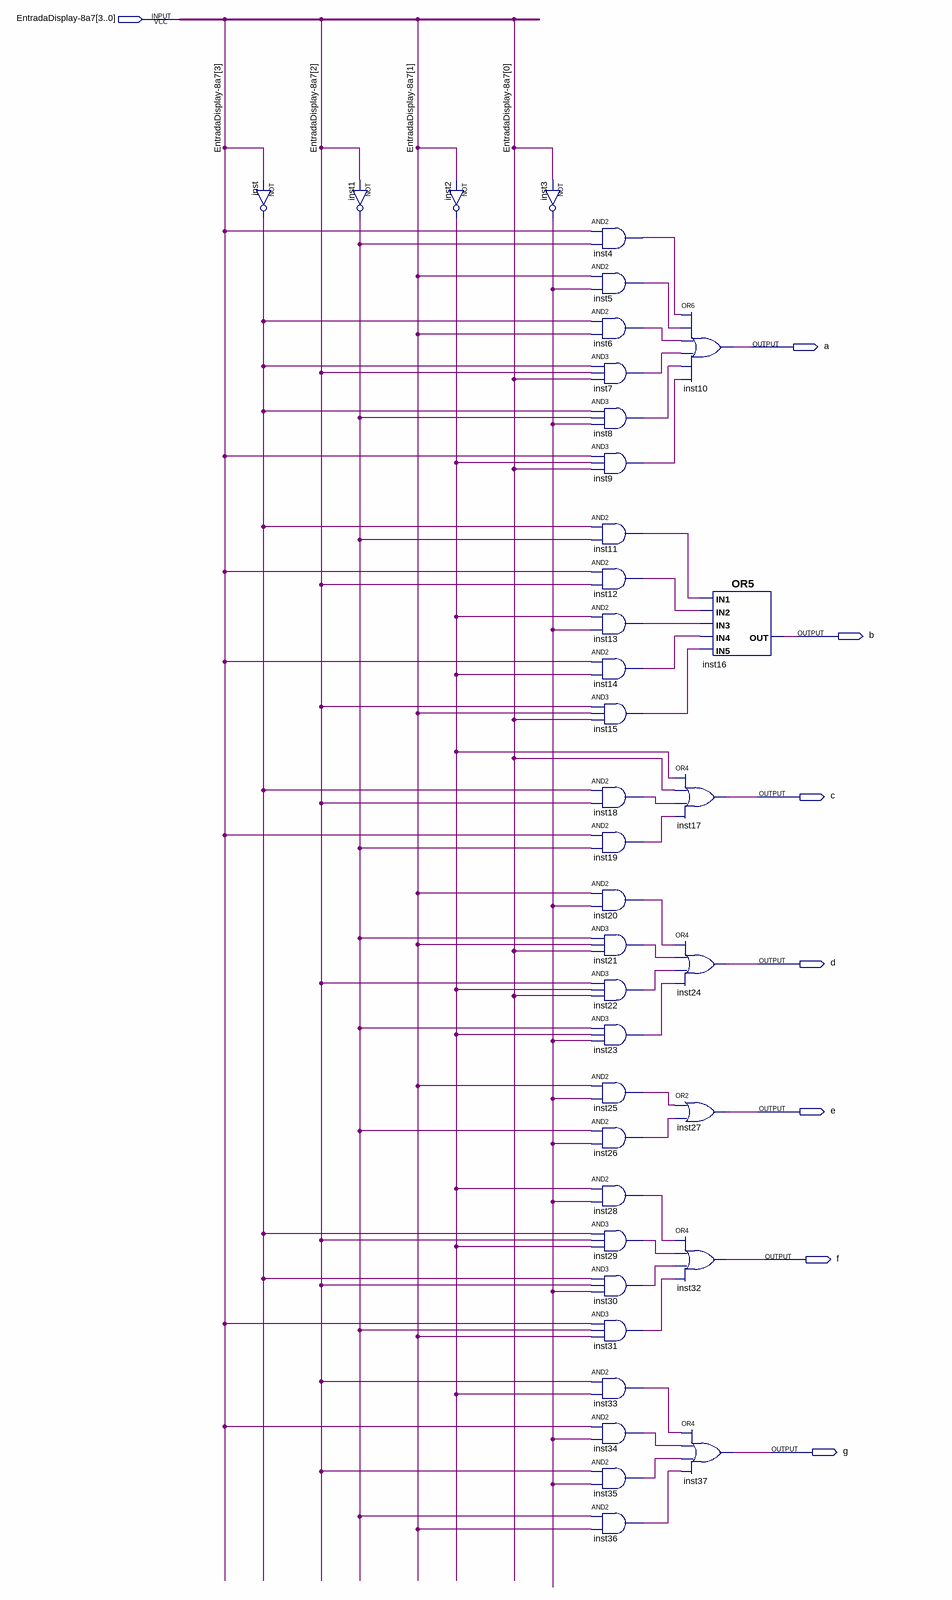
[diagram p0: schematic sheet]
// Quartus schematic Display-8a7.bdf as structural Verilog: 38 symbols, 8 pins
module \Display-8a7  (
  input  [3:0] \EntradaDisplay-8a7 ,
  output a,
  output b,
  output c,
  output d,
  output e,
  output f,
  output g
);

  wire inst1_out, inst2_out, inst3_out, inst4_out, inst5_out, inst6_out, inst7_out, inst8_out, inst9_out,
       inst11_out, inst12_out, inst13_out, inst14_out, inst15_out, inst18_out, inst19_out, inst20_out,
       inst21_out, inst22_out, inst23_out, inst25_out, inst26_out, inst28_out, inst29_out, inst30_out,
       inst31_out, inst33_out, inst34_out, inst35_out, inst36_out, inst_out;

  not inst (inst_out, \EntradaDisplay-8a7 [3]);
  not inst1 (inst1_out, \EntradaDisplay-8a7 [2]);
  not inst2 (inst2_out, \EntradaDisplay-8a7 [1]);
  not inst3 (inst3_out, \EntradaDisplay-8a7 [0]);
  and inst4 (inst4_out, \EntradaDisplay-8a7 [3], inst1_out);
  and inst5 (inst5_out, \EntradaDisplay-8a7 [1], inst3_out);
  and inst6 (inst6_out, inst_out, \EntradaDisplay-8a7 [1]);
  and inst7 (inst7_out, inst_out, \EntradaDisplay-8a7 [2], \EntradaDisplay-8a7 [0]);
  and inst8 (inst8_out, inst_out, inst1_out, inst3_out);
  and inst9 (inst9_out, \EntradaDisplay-8a7 [3], inst2_out, \EntradaDisplay-8a7 [0]);
  and inst11 (inst11_out, inst_out, inst1_out);
  and inst12 (inst12_out, \EntradaDisplay-8a7 [3], \EntradaDisplay-8a7 [2]);
  and inst13 (inst13_out, inst2_out, inst3_out);
  and inst14 (inst14_out, \EntradaDisplay-8a7 [3], inst2_out);
  and inst15 (inst15_out, \EntradaDisplay-8a7 [2], \EntradaDisplay-8a7 [1], \EntradaDisplay-8a7 [0]);
  and inst18 (inst18_out, inst_out, \EntradaDisplay-8a7 [2]);
  and inst19 (inst19_out, \EntradaDisplay-8a7 [3], inst1_out);
  and inst20 (inst20_out, \EntradaDisplay-8a7 [1], inst3_out);
  and inst21 (inst21_out, inst1_out, \EntradaDisplay-8a7 [1], \EntradaDisplay-8a7 [0]);
  and inst22 (inst22_out, \EntradaDisplay-8a7 [2], inst2_out, \EntradaDisplay-8a7 [0]);
  and inst23 (inst23_out, inst1_out, inst2_out, inst3_out);
  and inst25 (inst25_out, \EntradaDisplay-8a7 [1], inst3_out);
  and inst26 (inst26_out, inst1_out, inst3_out);
  and inst28 (inst28_out, inst2_out, inst3_out);
  and inst29 (inst29_out, inst_out, \EntradaDisplay-8a7 [2], inst2_out);
  and inst30 (inst30_out, inst_out, \EntradaDisplay-8a7 [2], inst3_out);
  and inst31 (inst31_out, \EntradaDisplay-8a7 [3], inst1_out, \EntradaDisplay-8a7 [1]);
  and inst33 (inst33_out, \EntradaDisplay-8a7 [2], inst2_out);
  and inst34 (inst34_out, \EntradaDisplay-8a7 [3], inst3_out);
  and inst35 (inst35_out, \EntradaDisplay-8a7 [2], inst3_out);
  and inst36 (inst36_out, inst1_out, \EntradaDisplay-8a7 [1]);
  or inst10 (a, inst4_out, inst5_out, inst6_out, inst7_out, inst8_out, inst9_out);
  or inst16 (b, inst11_out, inst12_out, inst13_out, inst14_out, inst15_out);
  or inst17 (c, inst2_out, \EntradaDisplay-8a7 [0], inst18_out, inst19_out);
  or inst24 (d, inst20_out, inst21_out, inst22_out, inst23_out);
  or inst27 (e, inst25_out, inst26_out);
  or inst32 (f, inst28_out, inst29_out, inst30_out, inst31_out);
  or inst37 (g, inst33_out, inst34_out, inst35_out, inst36_out);
endmodule
